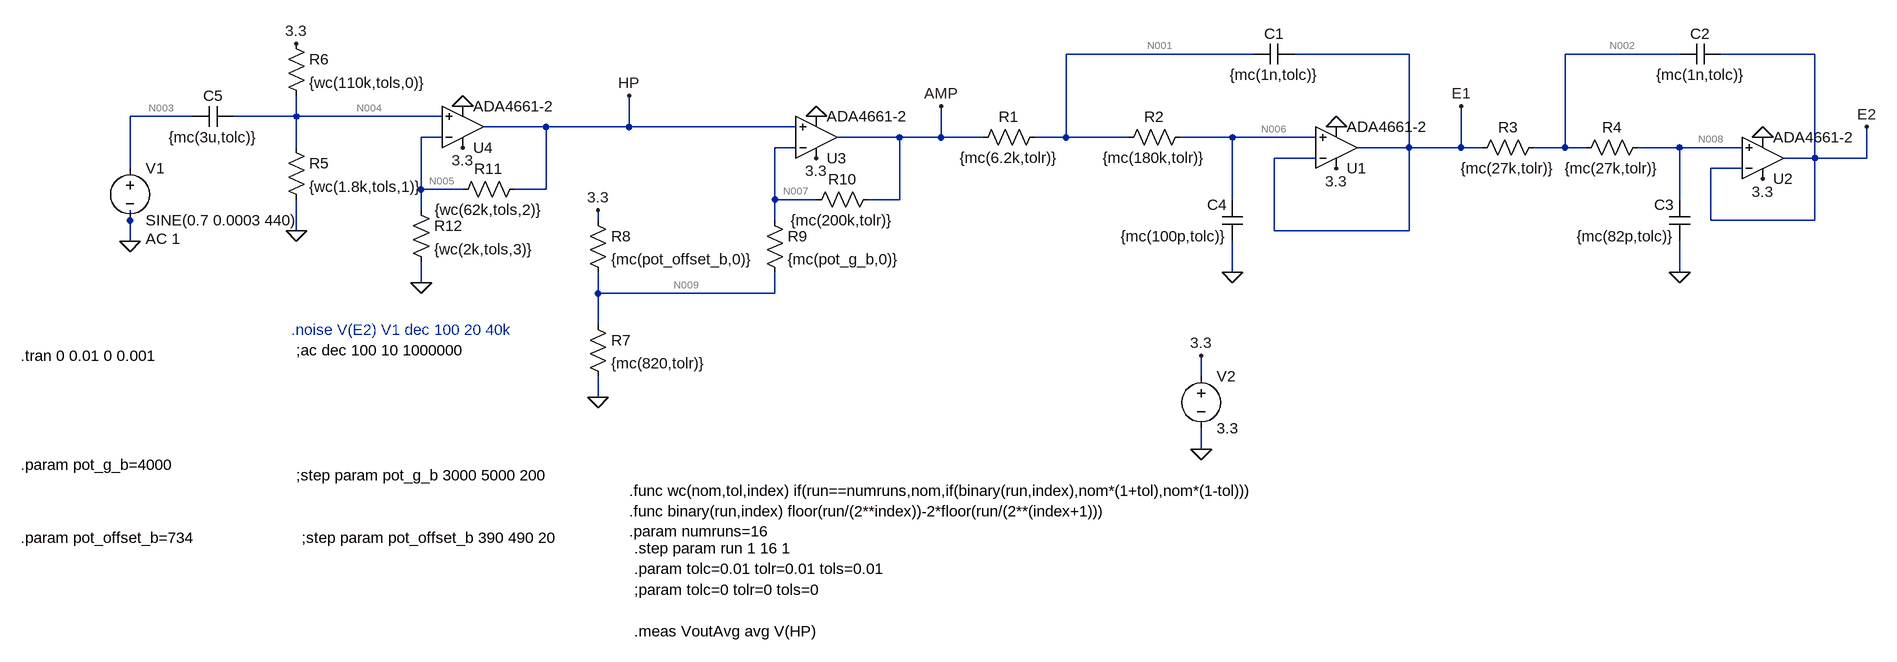
[diagram p0: schematic WorstCases.asc]
WorstCases.asc, the LTspice schematic file:
Version 4
SHEET 1 1724 896
WIRE -416 -16 -704 -16
WIRE -176 -16 -352 -16
WIRE 240 -16 64 -16
WIRE 448 -16 304 -16
WIRE -2048 80 -2144 80
WIRE -1888 80 -1888 48
WIRE -1888 80 -1984 80
WIRE -1664 80 -1888 80
WIRE -1504 96 -1600 96
WIRE -1376 96 -1376 48
WIRE -1376 96 -1504 96
WIRE -1120 96 -1376 96
WIRE -1664 112 -1696 112
WIRE -960 112 -1056 112
WIRE -896 112 -896 64
WIRE -896 112 -960 112
WIRE -832 112 -896 112
WIRE -704 112 -704 -16
WIRE -704 112 -752 112
WIRE -608 112 -704 112
WIRE -448 112 -528 112
WIRE -320 112 -448 112
WIRE -1888 128 -1888 80
WIRE -1120 128 -1152 128
WIRE -176 128 -176 -16
WIRE -176 128 -256 128
WIRE -96 128 -96 64
WIRE -96 128 -176 128
WIRE -64 128 -96 128
WIRE 64 128 64 -16
WIRE 64 128 16 128
WIRE 96 128 64 128
WIRE 240 128 176 128
WIRE 336 128 240 128
WIRE -320 144 -384 144
WIRE 448 144 448 -16
WIRE 448 144 400 144
WIRE 528 144 528 96
WIRE 528 144 448 144
WIRE -2144 160 -2144 80
WIRE 336 160 288 160
WIRE -1696 192 -1696 112
WIRE -1632 192 -1696 192
WIRE -1504 192 -1504 96
WIRE -1504 192 -1552 192
WIRE -1152 208 -1152 128
WIRE -1088 208 -1152 208
WIRE -960 208 -960 112
WIRE -960 208 -1008 208
WIRE -448 208 -448 112
WIRE 240 208 240 128
WIRE -1696 224 -1696 192
WIRE -2144 240 -2144 224
WIRE -1424 240 -1424 224
WIRE -1152 240 -1152 208
WIRE 288 240 288 160
WIRE 448 240 448 144
WIRE 448 240 288 240
WIRE -1888 256 -1888 208
WIRE -384 256 -384 144
WIRE -176 256 -176 128
WIRE -176 256 -384 256
WIRE -2144 272 -2144 240
WIRE -448 320 -448 272
WIRE 240 320 240 272
WIRE -1696 336 -1696 304
WIRE -1424 352 -1424 320
WIRE -1152 352 -1152 320
WIRE -1152 352 -1424 352
WIRE -1424 400 -1424 352
WIRE -496 480 -496 448
WIRE -1424 512 -1424 480
WIRE -496 592 -496 560
FLAG 368 112 0
FLAG -2144 272 0
FLAG -496 592 0
FLAG -496 448 3.3
FLAG 368 176 3.3
FLAG -96 64 E1
FLAG -1888 256 0
FLAG -1632 64 0
FLAG -448 320 0
FLAG 240 320 0
FLAG -1632 128 3.3
FLAG -1888 -32 3.3
FLAG -1696 336 0
FLAG -288 160 3.3
FLAG -288 96 0
FLAG 528 96 E2
FLAG -1088 80 0
FLAG -1088 144 3.3
FLAG -1424 512 0
FLAG -1424 224 3.3
FLAG -1376 48 HP
FLAG -896 64 AMP
SYMBOL Opamps\\ADA4661-2 -288 192 M180
SYMATTR InstName U1
SYMBOL Opamps\\ADA4661-2 368 208 M180
SYMATTR InstName U2
SYMBOL res -736 96 R90
WINDOW 0 0 56 VBottom 2
WINDOW 3 32 56 VTop 2
SYMATTR InstName R1
SYMATTR Value {mc(6.2k,tolr)}
SYMATTR SpiceLine tol=1
SYMBOL res -512 96 R90
WINDOW 0 0 56 VBottom 2
WINDOW 3 32 56 VTop 2
SYMATTR InstName R2
SYMATTR Value {mc(180k,tolr)}
SYMATTR SpiceLine tol=1
SYMBOL res 32 112 R90
WINDOW 0 0 56 VBottom 2
WINDOW 3 32 56 VTop 2
SYMATTR InstName R3
SYMATTR Value {mc(27k,tolr)}
SYMATTR SpiceLine tol=1
SYMBOL res 192 112 R90
WINDOW 0 0 56 VBottom 2
WINDOW 3 32 56 VTop 2
SYMATTR InstName R4
SYMATTR Value {mc(27k,tolr)}
SYMATTR SpiceLine tol=1
SYMBOL cap -352 -32 R90
WINDOW 0 0 32 VBottom 2
WINDOW 3 32 32 VTop 2
SYMATTR InstName C1
SYMATTR Value {mc(1n,tolc)}
SYMBOL cap 304 -32 R90
WINDOW 0 0 32 VBottom 2
WINDOW 3 32 32 VTop 2
SYMATTR InstName C2
SYMATTR Value {mc(1n,tolc)}
SYMBOL cap 256 272 R180
WINDOW 0 24 56 Left 2
WINDOW 3 24 8 Left 2
SYMATTR InstName C3
SYMATTR Value {mc(82p,tolc)}
SYMBOL cap -432 272 R180
WINDOW 0 24 56 Left 2
WINDOW 3 24 8 Left 2
SYMATTR InstName C4
SYMATTR Value {mc(100p,tolc)}
SYMBOL voltage -2144 144 R0
WINDOW 123 24 124 Left 2
WINDOW 39 0 0 Left 0
SYMATTR Value2 AC 1
SYMATTR InstName V1
SYMATTR Value SINE(0.7 0.0003 440)
SYMBOL voltage -496 464 R0
WINDOW 123 0 0 Left 0
WINDOW 39 0 0 Left 0
SYMATTR InstName V2
SYMATTR Value 3.3
SYMBOL cap -1984 64 R90
WINDOW 0 0 32 VBottom 2
WINDOW 3 32 32 VTop 2
SYMATTR InstName C5
SYMATTR Value {mc(3u,tolc)}
SYMBOL res -1904 112 R0
SYMATTR InstName R5
SYMATTR Value {wc(1.8k,tols,1)}
SYMBOL Opamps\\ADA4661-2 -1632 160 M180
SYMATTR InstName U4
SYMBOL res -1904 -48 R0
SYMATTR InstName R6
SYMATTR Value {wc(110k,tols,0)}
SYMBOL res -1648 208 R270
WINDOW 0 32 56 VTop 2
WINDOW 3 0 56 VBottom 2
SYMATTR InstName R11
SYMATTR Value {wc(62k,tols,2)}
SYMBOL res -1712 208 R0
SYMATTR InstName R12
SYMATTR Value {wc(2k,tols,3)}
SYMBOL Opamps\\ADA4661-2 -1088 176 M180
SYMATTR InstName U3
SYMBOL res -1168 224 R0
SYMATTR InstName R9
SYMATTR Value {mc(pot_g_b,0)}
SYMBOL res -992 192 R90
WINDOW 0 0 56 VBottom 2
WINDOW 3 32 56 VTop 2
SYMATTR InstName R10
SYMATTR Value {mc(200k,tolr)}
SYMBOL res -1440 384 R0
SYMATTR InstName R7
SYMATTR Value {mc(820,tolr)}
SYMBOL res -1440 224 R0
SYMATTR InstName R8
SYMATTR Value {mc(pot_offset_b,0)}
TEXT -2312 448 Left 2 !.tran 0 0.01 0 0.001
TEXT -1896 408 Left 2 ;.noise V(E2) V1 dec 100 20 40k
TEXT -1888 440 Left 2 !;ac dec 100 10 1000000
TEXT -1888 632 Left 2 !;step param pot_g_b 3000 5000 200
TEXT -2312 616 Left 2 !.param pot_g_b=4000
TEXT -2312 728 Left 2 !.param pot_offset_b=734
TEXT -1880 728 Left 2 !;step param pot_offset_b 390 490 20
TEXT -1376 656 Left 2 !.func wc(nom,tol,index) if(run==numruns,nom,if(binary(run,index),nom*(1+tol),nom*(1-tol)))\n.func binary(run,index) floor(run/(2**index))-2*floor(run/(2**(index+1)))\n.param numruns=16
TEXT -1368 744 Left 2 !.step param run 1 16 1
TEXT -1368 776 Left 2 !.param tolc=0.01 tolr=0.01 tols=0.01
TEXT -1368 808 Left 2 !;param tolc=0 tolr=0 tols=0
TEXT -1368 872 Left 2 !.meas VoutAvg avg V(HP)

The netlist it stands for:
* WorstCases.asc
XU1 N006 E1 3.3 0 E1 ADA4661-2  ; pins In+ In- V+ V- OUT
XU2 N008 E2 3.3 0 E2 ADA4661-2  ; pins In+ In- V+ V- OUT
R1 N001 AMP {mc(6.2k,tolr)} tol=1
R2 N006 N001 {mc(180k,tolr)} tol=1
R3 N002 E1 {mc(27k,tolr)} tol=1
R4 N008 N002 {mc(27k,tolr)} tol=1
C1 E1 N001 {mc(1n,tolc)}
C2 E2 N002 {mc(1n,tolc)}
C3 0 N008 {mc(82p,tolc)}
C4 0 N006 {mc(100p,tolc)}
V1 N003 0 SINE(0.7 0.0003 440) AC 1
V2 3.3 0 3.3
C5 N004 N003 {mc(3u,tolc)}
R5 N004 0 {wc(1.8k,tols,1)}
XU4 N004 N005 3.3 0 HP ADA4661-2  ; pins In+ In- V+ V- OUT
R6 3.3 N004 {wc(110k,tols,0)}
R11 N005 HP {wc(62k,tols,2)}
R12 N005 0 {wc(2k,tols,3)}
XU3 HP N007 3.3 0 AMP ADA4661-2  ; pins In+ In- V+ V- OUT
R9 N007 N009 {mc(pot_g_b,0)}
R10 AMP N007 {mc(200k,tolr)}
R7 N009 0 {mc(820,tolr)}
R8 3.3 N009 {mc(pot_offset_b,0)}
.tran 0 0.01 0 0.001
* .noise V(E2) V1 dec 100 20 40k
;ac dec 100 10 1000000
;step param pot_g_b 3000 5000 200
.param pot_g_b=4000
.param pot_offset_b=734
;step param pot_offset_b 390 490 20
.func wc(nom,tol,index) if(run==numruns,nom,if(binary(run,index),nom*(1+tol),nom*(1-tol)))
.func binary(run,index) floor(run/(2**index))-2*floor(run/(2**(index+1)))
.param numruns=16
.step param run 1 16 1
.param tolc=0.01 tolr=0.01 tols=0.01
;param tolc=0 tolr=0 tols=0
.meas VoutAvg avg V(HP)
.lib ADI1.lib
.backanno
.end

* Results of the author's LTspice run, read from the files saved beside the schematic
* Operating Point (first step), zero values left out:
*   run = 1 
*   V(e1) = 695 µV
*   V(3.3) = 3.3 V
*   V(n006) = 235.4 µV
*   V(e2) = 1.154 mV
*   V(n008) = 694.9 µV
*   V(n001) = 235.6 µV
*   V(amp) = 235.6 µV
*   V(n002) = 694.9 µV
*   V(n003) = 700 mV
*   V(n004) = 52.1 mV
*   V(n005) = 52.55 mV
*   V(hp) = 1.682 V
*   V(n007) = 1.709 V
*   V(n009) = 1.744 V
*   I(R8) = 2.12 mA
*   I(R7) = 2.111 mA
*   I(R10) = -8.602 µA
*   I(R9) = -8.602 µA
*   I(R12) = 26.54 µA
*   I(R11) = -26.54 µA
*   I(R6) = 29.23 µA
*   I(R5) = 29.23 µA
*   I(R4) = -1.5 pA
*   I(R3) = -1.5 pA
*   I(R2) = -1.5 pA
*   I(R1) = -1.5 pA
*   I(V2) = -4.196 mA
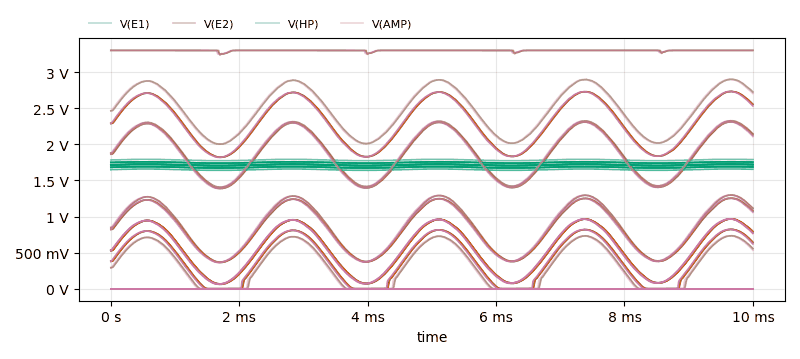
[diagram p1: Transient Analysis of WorstCases.asc, plotted from the saved traces]
* Transient Analysis, 16 runs:
*   V(E1) [run=1]: min 694 µV, max 696.4 µV, average 695.1 µV, rms 695.1 µV, last 695.7 µV
*   V(E1) [run=2]: min 2.002 V, max 2.898 V, average 2.478 V, rms 2.498 V, last 2.721 V
*   V(E1) [run=3]: min 698.8 µV, max 734.1 mV, average 333.4 mV, rms 436.3 mV, last 553.1 mV
*   V(E1) [run=4]: min 1.407 V, max 2.326 V, average 1.894 V, rms 1.921 V, last 2.143 V
*   V(E1) [run=5]: min 369.9 mV, max 1.298 V, average 861.6 mV, rms 919.6 mV, last 1.112 V
*   V(E1) [run=6]: min 3.249 V, max 3.3 V, average 3.298 V, rms 3.298 V, last 3.3 V
*   V(E1) [run=7]: min 1.388 V, max 2.311 V, average 1.878 V, rms 1.905 V, last 2.127 V
*   V(E1) [run=8]: min 690 µV, max 694.4 µV, average 692 µV, rms 692 µV, last 692.9 µV
*   V(E2) [run=1]: min 1.153 mV, max 1.156 mV, average 1.154 mV, rms 1.154 mV, last 1.155 mV
*   V(E2) [run=2]: min 2.003 V, max 2.899 V, average 2.479 V, rms 2.498 V, last 2.726 V
*   V(E2) [run=3]: min 1.105 mV, max 734.9 mV, average 333.7 mV, rms 436.6 mV, last 558.3 mV
*   V(E2) [run=4]: min 1.407 V, max 2.326 V, average 1.895 V, rms 1.921 V, last 2.148 V
*   V(E2) [run=5]: min 370.4 mV, max 1.298 V, average 862 mV, rms 919.9 mV, last 1.118 V
*   V(E2) [run=6]: min 3.236 V, max 3.3 V, average 3.298 V, rms 3.298 V, last 3.3 V
*   V(E2) [run=7]: min 1.389 V, max 2.311 V, average 1.878 V, rms 1.905 V, last 2.132 V
*   V(E2) [run=8]: min 1.149 mV, max 1.154 mV, average 1.151 mV, rms 1.151 mV, last 1.152 mV
*   V(HP) [run=1]: min 1.672 V, max 1.691 V, average 1.682 V, rms 1.682 V, last 1.687 V
*   V(HP) [run=2]: min 1.739 V, max 1.758 V, average 1.749 V, rms 1.749 V, last 1.754 V
*   V(HP) [run=3]: min 1.705 V, max 1.724 V, average 1.715 V, rms 1.715 V, last 1.72 V
*   V(HP) [run=4]: min 1.738 V, max 1.758 V, average 1.749 V, rms 1.749 V, last 1.753 V
*   V(HP) [run=5]: min 1.704 V, max 1.724 V, average 1.715 V, rms 1.715 V, last 1.72 V
*   V(HP) [run=6]: min 1.773 V, max 1.792 V, average 1.783 V, rms 1.783 V, last 1.788 V
*   V(HP) [run=7]: min 1.738 V, max 1.758 V, average 1.749 V, rms 1.749 V, last 1.753 V
*   V(HP) [run=8]: min 1.672 V, max 1.691 V, average 1.682 V, rms 1.682 V, last 1.687 V
*   V(AMP) [run=1]: min 234.6 µV, max 237 µV, average 235.8 µV, rms 235.8 µV, last 236.3 µV
*   V(AMP) [run=2]: min 2.001 V, max 2.899 V, average 2.478 V, rms 2.498 V, last 2.701 V
*   V(AMP) [run=3]: min 239.4 µV, max 733.7 mV, average 333.5 mV, rms 436.7 mV, last 533.2 mV
*   V(AMP) [run=4]: min 1.406 V, max 2.325 V, average 1.894 V, rms 1.921 V, last 2.122 V
*   V(AMP) [run=5]: min 368.8 mV, max 1.297 V, average 861.7 mV, rms 919.8 mV, last 1.092 V
*   V(AMP) [run=6]: min 3.248 V, max 3.299 V, average 3.297 V, rms 3.297 V, last 3.299 V
*   V(AMP) [run=7]: min 1.388 V, max 2.311 V, average 1.878 V, rms 1.905 V, last 2.107 V
*   V(AMP) [run=8]: min 230.7 µV, max 235.1 µV, average 232.7 µV, rms 232.7 µV, last 233.5 µV
* From the log:
*   Measurement: voutavg
*     step  AVG(v(hp))  FROM  TO
*        1  1.68196  0  0.01
*        2  1.74888  0  0.01
*        3  1.71509  0  0.01
*        4  1.74864  0  0.01
*        5  1.71486  0  0.01
*        6  1.78308  0  0.01
*        7  1.74864  0  0.01
*        8  1.6822  0  0.01
*        9  1.64968  0  0.01
*       10  1.71532  0  0.01
*       11  1.6822  0  0.01
*       12  1.71512  0  0.01
*       13  1.68196  0  0.01
*       14  1.74888  0  0.01
*       15  1.71509  0  0.01
*       16  1.71512  0  0.01